# EAGLE design M633 (EAGLE 6.6.0)
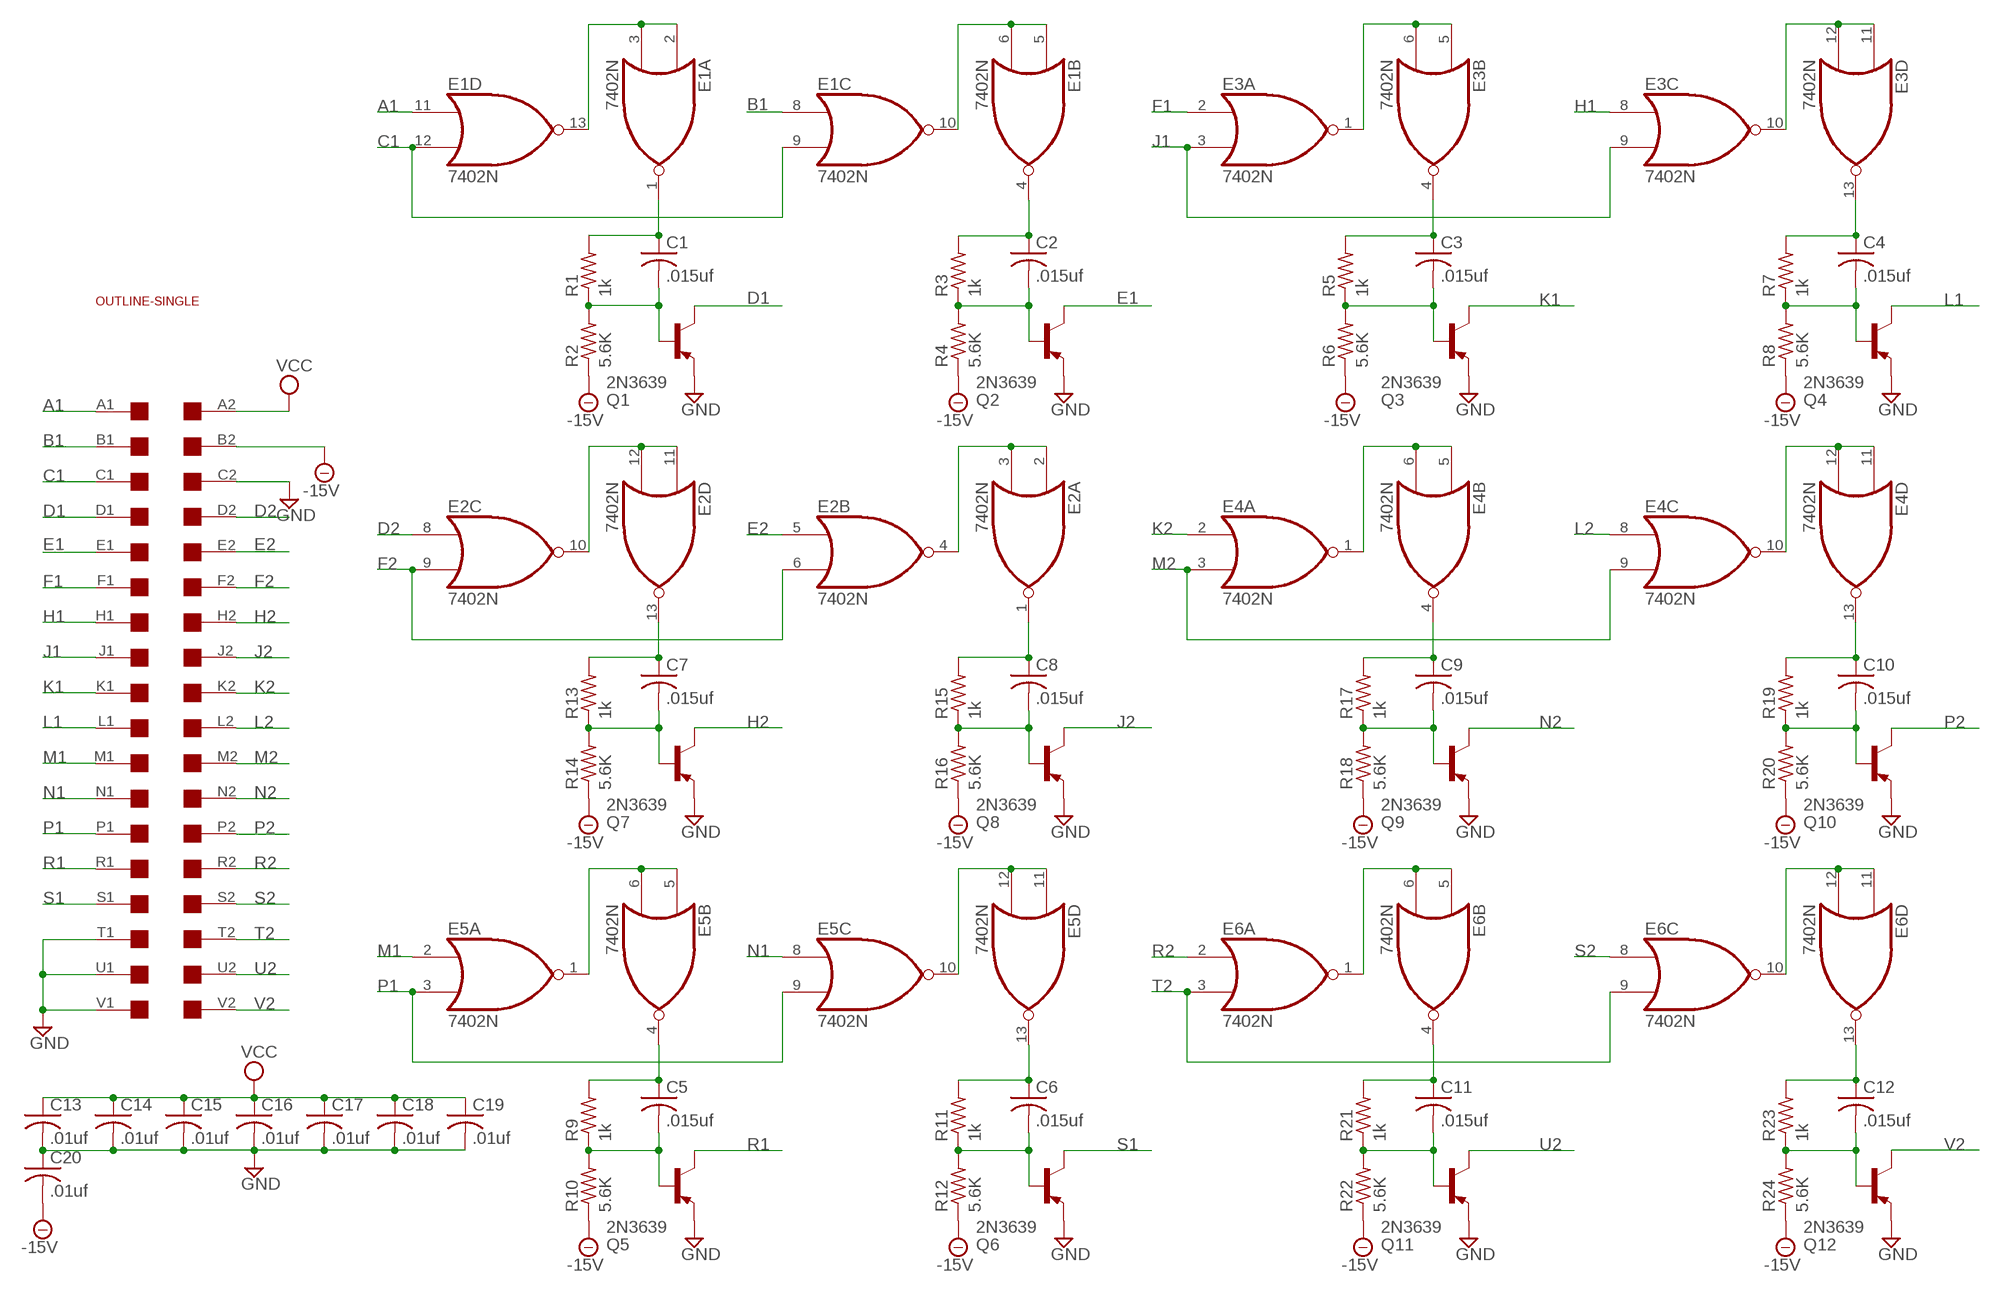
[diagram p0: schematic, sheet 1]

## Parts
C1  .015uf  C-US050-025X075  [C050-025X075]
C2  .015uf  C-US050-025X075  [C050-025X075]
C3  .015uf  C-US050-025X075  [C050-025X075]
C4  .015uf  C-US050-025X075  [C050-025X075]
C5  .015uf  C-US050-025X075  [C050-025X075]
C6  .015uf  C-US050-025X075  [C050-025X075]
C7  .015uf  C-US050-025X075  [C050-025X075]
C8  .015uf  C-US050-025X075  [C050-025X075]
C9  .015uf  C-US050-025X075  [C050-025X075]
C10  .015uf  C-US050-025X075  [C050-025X075]
C11  .015uf  C-US050-025X075  [C050-025X075]
C12  .015uf  C-US050-025X075  [C050-025X075]
C13  .01uf  C-US050-025X075  [C050-025X075]
C14  .01uf  C-US050-025X075  [C050-025X075]
C15  .01uf  C-US050-025X075  [C050-025X075]
C16  .01uf  C-US050-025X075  [C050-025X075]
C17  .01uf  C-US050-025X075  [C050-025X075]
C18  .01uf  C-US050-025X075  [C050-025X075]
C19  .01uf  C-US050-025X075  [C050-025X075]
C20  .01uf  C-US050-025X075  [C050-025X075]
E1  7402N  [DIL14]
E2  7402N  [DIL14]
E3  7402N  [DIL14]
E4  7402N  [DIL14]
E5  7402N  [DIL14]
E6  7402N  [DIL14]
Q1  2N3639  2N5415  [TO39]
Q2  2N3639  2N5415  [TO39]
Q3  2N3639  2N5415  [TO39]
Q4  2N3639  2N5415  [TO39]
Q5  2N3639  2N5415  [TO39]
Q6  2N3639  2N5415  [TO39]
Q7  2N3639  2N5415  [TO39]
Q8  2N3639  2N5415  [TO39]
Q9  2N3639  2N5415  [TO39]
Q10  2N3639  2N5415  [TO39]
Q11  2N3639  2N5415  [TO39]
Q12  2N3639  2N5415  [TO39]
R1  1k  R-US_0207/10  [0207/10]
R2  5.6K  R-US_0207/10  [0207/10]
R3  1k  R-US_0207/10  [0207/10]
R4  5.6K  R-US_0207/10  [0207/10]
R5  1k  R-US_0207/10  [0207/10]
R6  5.6K  R-US_0207/10  [0207/10]
R7  1k  R-US_0207/10  [0207/10]
R8  5.6K  R-US_0207/10  [0207/10]
R9  1k  R-US_0207/10  [0207/10]
R10  5.6K  R-US_0207/10  [0207/10]
R11  1k  R-US_0207/10  [0207/10]
R12  5.6K  R-US_0207/10  [0207/10]
R13  1k  R-US_0207/10  [0207/10]
R14  5.6K  R-US_0207/10  [0207/10]
R15  1k  R-US_0207/10  [0207/10]
R16  5.6K  R-US_0207/10  [0207/10]
R17  1k  R-US_0207/10  [0207/10]
R18  5.6K  R-US_0207/10  [0207/10]
R19  1k  R-US_0207/10  [0207/10]
R20  5.6K  R-US_0207/10  [0207/10]
R21  1k  R-US_0207/10  [0207/10]
R22  5.6K  R-US_0207/10  [0207/10]
R23  1k  R-US_0207/10  [0207/10]
R24  5.6K  R-US_0207/10  [0207/10]
U$1  SINGLE  [EDGE-CON2]
U$2  OUTLINE-SINGLE  [SINGLE]

## Nets
-15V: C20.2 R2.1 R4.1 R6.1 R8.1 R10.1 R12.1 R14.1 R16.1 R18.1 R20.1 R22.1 R24.1 U$1.B2
A1: E1.11(D:I0) U$1.A1
B1: E1.8(C:I0) U$1.B1
C1: E1.9(C:I1) E1.12(D:I1) U$1.C1
D1: Q1.3(C) U$1.D1
D2: E2.8(C:I0) U$1.D2
E1: Q2.3(C) U$1.E1
E2: E2.5(B:I0) U$1.E2
F1: E3.2(A:I0) U$1.F1
F2: E2.6(B:I1) E2.9(C:I1) U$1.F2
GND: C13.2 C14.2 C15.2 C16.2 C17.2 C18.2 C19.2 C20.1 Q1.1(E) Q2.1(E) Q3.1(E) Q4.1(E) Q5.1(E) Q6.1(E) Q7.1(E) Q8.1(E) Q9.1(E) Q10.1(E) Q11.1(E) Q12.1(E) U$1.C2 U$1.T1 U$1.U1 U$1.V1
H1: E3.8(C:I0) U$1.H1
H2: Q7.3(C) U$1.H2
J1: E3.3(A:I1) E3.9(C:I1) U$1.J1
J2: Q8.3(C) U$1.J2
K1: Q3.3(C) U$1.K1
K2: E4.2(A:I0) U$1.K2
L1: Q4.3(C) U$1.L1
L2: E4.8(C:I0) U$1.L2
M1: E5.2(A:I0) U$1.M1
M2: E4.3(A:I1) E4.9(C:I1) U$1.M2
N1: E5.8(C:I0) U$1.N1
N2: Q9.3(C) U$1.N2
N$1: E1.2(A:I0) E1.3(A:I1) E1.13(D:O)
N$2: C1.1 E1.1(A:O) R1.2
N$3: C1.2 Q1.2(B) R1.1 R2.2
N$4: C3.1 E3.4(B:O) R5.2
N$5: C2.1 E1.4(B:O) R3.2
N$6: C2.2 Q2.2(B) R3.1 R4.2
N$7: E1.5(B:I0) E1.6(B:I1) E1.10(C:O)
N$8: E2.10(C:O) E2.11(D:I0) E2.12(D:I1)
N$9: E2.2(A:I0) E2.3(A:I1) E2.4(B:O)
N$10: E4.1(A:O) E4.5(B:I0) E4.6(B:I1)
N$11: E4.10(C:O) E4.11(D:I0) E4.12(D:I1)
N$12: E6.10(C:O) E6.11(D:I0) E6.12(D:I1)
N$13: E6.1(A:O) E6.5(B:I0) E6.6(B:I1)
N$14: E5.10(C:O) E5.11(D:I0) E5.12(D:I1)
N$15: E5.1(A:O) E5.5(B:I0) E5.6(B:I1)
N$16: E3.10(C:O) E3.11(D:I0) E3.12(D:I1)
N$17: E3.1(A:O) E3.5(B:I0) E3.6(B:I1)
N$18: C4.1 E3.13(D:O) R7.2
N$19: C9.1 E4.4(B:O) R17.2
N$20: C10.1 E4.13(D:O) R19.2
N$21: C8.1 E2.1(A:O) R15.2
N$22: C7.1 E2.13(D:O) R13.2
N$23: C7.2 Q7.2(B) R13.1 R14.2
N$24: C8.2 Q8.2(B) R15.1 R16.2
N$25: C9.2 Q9.2(B) R17.1 R18.2
N$26: C10.2 Q10.2(B) R19.1 R20.2
N$27: C5.1 E5.4(B:O) R9.2
N$28: C5.2 Q5.2(B) R9.1 R10.2
N$29: C6.2 Q6.2(B) R11.1 R12.2
N$30: C11.2 Q11.2(B) R21.1 R22.2
N$31: C12.2 Q12.2(B) R23.1 R24.2
N$32: C6.1 E5.13(D:O) R11.2
N$33: C11.1 E6.4(B:O) R21.2
N$34: C12.1 E6.13(D:O) R23.2
N$35: C3.2 Q3.2(B) R5.1 R6.2
N$36: C4.2 Q4.2(B) R7.1 R8.2
P1: E5.3(A:I1) E5.9(C:I1) U$1.P1
P2: Q10.3(C) U$1.P2
R1: Q5.3(C) U$1.R1
R2: E6.2(A:I0) U$1.R2
S1: Q6.3(C) U$1.S1
S2: E6.8(C:I0) U$1.S2
T2: E6.3(A:I1) E6.9(C:I1) U$1.T2
U2: Q11.3(C) U$1.U2
V2: Q12.3(C) U$1.V2
VCC: C13.1 C14.1 C15.1 C16.1 C17.1 C18.1 C19.1 U$1.A2

## Power pins joined to a net without a drawn wire
GND: E1.7(P:GND) E2.7(P:GND) E3.7(P:GND) E4.7(P:GND) E5.7(P:GND) E6.7(P:GND)
VCC: E1.14(P:VCC) E2.14(P:VCC) E3.14(P:VCC) E4.14(P:VCC) E5.14(P:VCC) E6.14(P:VCC)

## Library data of the parts
C1-C20 = rcl:C-US: CAPACITOR, American symbol
E1-E6 = 74xx-us:74*02: Quad 2-input NOR gate
Q1-Q12 = transistor-pnp:2N5415*: PNP Transistror
R1-R24 = rcl:R-US_: RESISTOR, American symbol
U$1 = dec-con:SINGLE: Single-Height DEC board
U$2 = dec-con:OUTLINE-*: Board outlines for DEC boards.

## Board
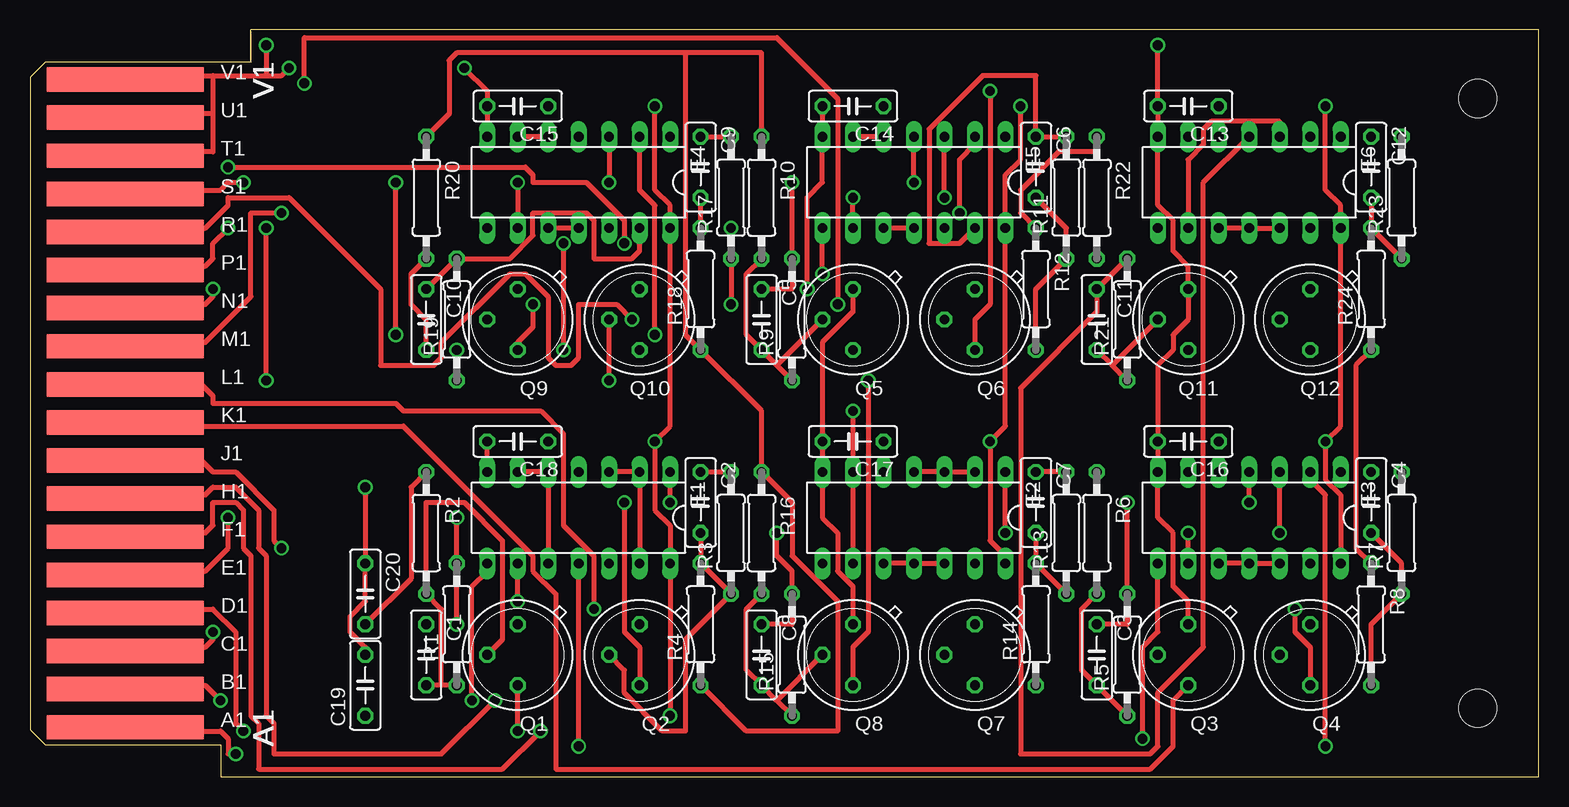
[diagram p1: board, top side]
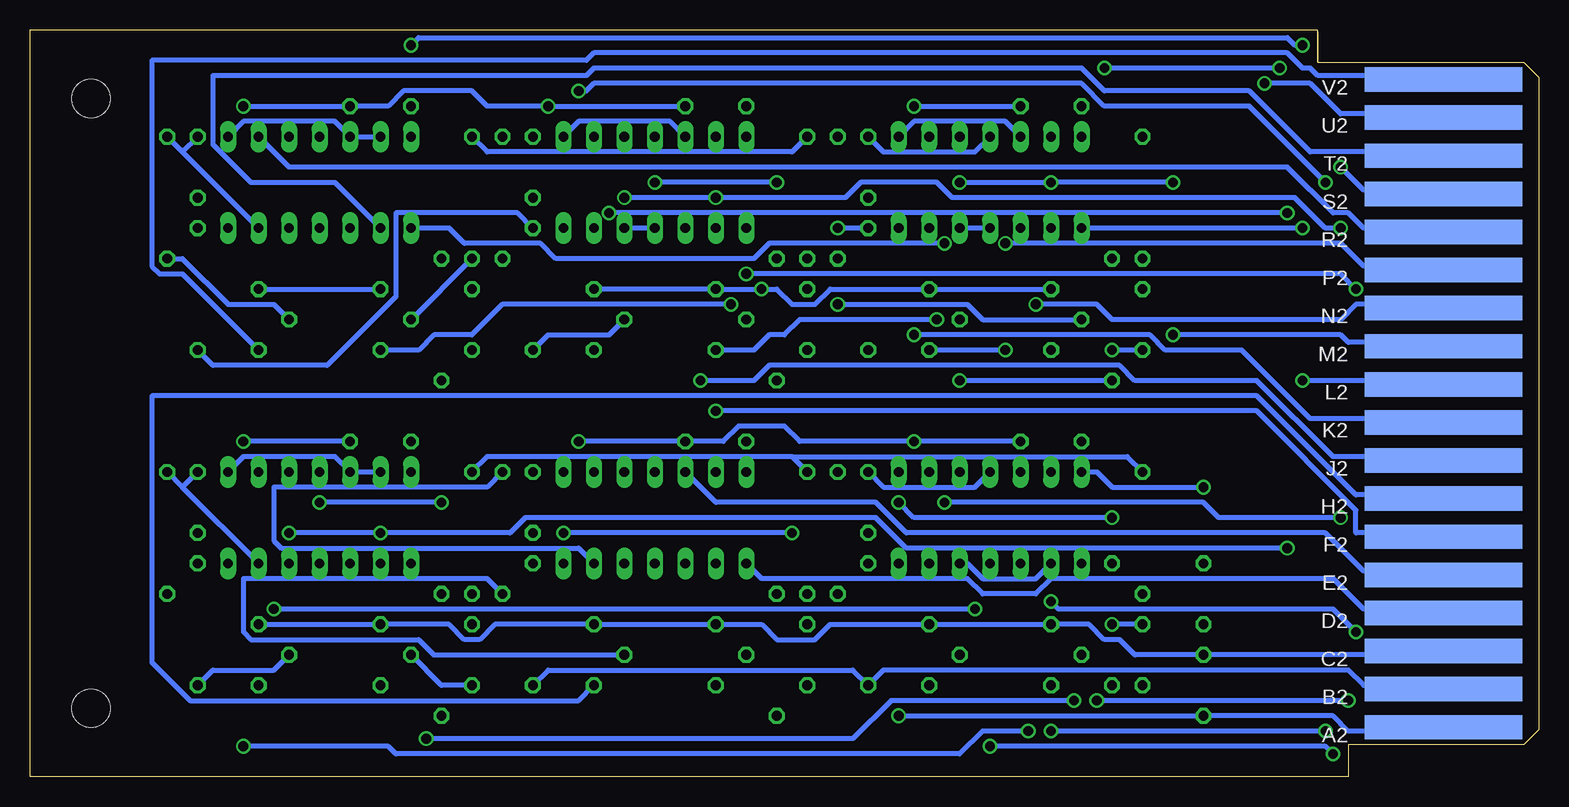
[diagram p2: board, bottom side, seen from below]

Size 125.73 x 62.23 mm. Coordinates in mm from the lower left corner, seen from the top.
Copper layers (1+16): Top 0.035mm / dielectric 1.5mm / Bottom 0.035mm
Design rules "16mils": minimum track width 16mil, minimum drill 32mil, track to track 15mil, track to pad 10mil, pad to pad 10mil, via to via 10mil, smd to smd 10mil, copper to edge 13mil, drill to drill 10mil, minimum pad ring 10mil, minimum via ring 8mil, stop-mask expansion 0mil, vias tented up to drill 0mil, thermal gap 10mil

### Footprints (pad centres in the part's own frame; a part is rotated, then mirrored left to right if it is on the bottom)
C050-025X075 = drill 0.813 octagon: 1 -2.54,0; 2 2.54,0
DIL14 = drill 0.813 long: 1 -7.62,-3.81; 2 -5.08,-3.81; 3 -2.54,-3.81; 4 0,-3.81; 5 2.54,-3.81; 6 5.08,-3.81; 7 7.62,-3.81; 8 7.62,3.81; 9 5.08,3.81; 10 2.54,3.81; 11 0,3.81; 12 -2.54,3.81; 13 -5.08,3.81; 14 -7.62,3.81
TO39 = drill 0.813 octagon: 1 0,-2.54; 2 2.54,0; 3 0,2.54
0207/10 = drill 0.813 octagon: 1 -5.08,0; 2 5.08,0
EDGE-CON2 = smd 13.106 x 2.032: A1 7.938,4.128; B1 7.938,7.303; C1 7.938,10.477; D1 7.938,13.652; E1 7.938,16.828; F1 7.938,20.003; H1 7.938,23.177; J1 7.938,26.352; K1 7.938,29.527; L1 7.938,32.703; M1 7.938,35.877; N1 7.938,39.053; P1 7.938,42.227; R1 7.938,45.403; S1 7.938,48.578; T1 7.938,51.752; U1 7.938,54.928; V1 7.938,58.102 | smd 13.106 x 2.032 bottom: A2 7.938,4.128; B2 7.938,7.303; C2 7.938,10.477; D2 7.938,13.652; E2 7.938,16.828; F2 7.938,20.003; H2 7.938,23.177; J2 7.938,26.352; K2 7.938,29.527; L2 7.938,32.703; M2 7.938,35.877; N2 7.938,39.053; P2 7.938,42.227; R2 7.938,45.403; S2 7.938,48.578; T2 7.938,51.752; U2 7.938,54.928; V2 7.938,58.102
SINGLE = hole 3.175: 120.65,56.515; 120.65,5.715

### Placement (x,y rotation side)
C1  33.02,10.16 270 top
C2  55.88,22.86 270 top
C3  88.9,10.16 270 top
C4  111.76,22.86 270 top
C5  60.96,38.1 270 top
C6  83.82,50.8 270 top
C7  83.82,22.86 270 top
C8  60.96,10.16 270 top
C9  55.88,50.8 270 top
C10  33.02,38.1 270 top
C11  88.9,38.1 270 top
C12  111.76,50.8 270 top
C13  96.52,55.88 180 top
C14  68.58,55.88 180 top
C15  40.64,55.88 180 top
C16  96.52,27.94 180 top
C17  68.58,27.94 180 top
C18  40.64,27.94 180 top
C19  27.94,7.62 90 top
C20  27.94,15.24 270 top
E1  45.72,21.59 180 top
E2  73.66,21.59 180 top
E3  101.6,21.59 180 top
E4  45.72,49.53 180 top
E5  73.66,49.53 180 top
E6  101.6,49.53 180 top
Q1  40.64,10.16 180 top
Q2  50.8,10.16 180 top
Q3  96.52,10.16 180 top
Q4  106.68,10.16 180 top
Q5  68.58,38.1 180 top
Q6  78.74,38.1 180 top
Q7  78.74,10.16 180 top
Q8  68.58,10.16 180 top
Q9  40.64,38.1 180 top
Q10  50.8,38.1 180 top
Q11  96.52,38.1 180 top
Q12  106.68,38.1 180 top
R1  35.56,12.7 90 top
R2  33.02,20.32 270 top
R3  58.42,20.32 90 top
R4  55.88,12.7 90 top
R5  91.44,10.16 90 top
R6  88.9,20.32 270 top
R7  114.3,20.32 90 top
R8  111.76,12.7 270 top
R9  63.5,38.1 90 top
R10  60.96,48.26 270 top
R11  86.36,48.26 90 top
R12  83.82,40.64 270 top
R13  86.36,20.32 90 top
R14  83.82,12.7 90 top
R15  63.5,10.16 90 top
R16  60.96,20.32 270 top
R17  58.42,48.26 90 top
R18  55.88,40.64 90 top
R19  35.56,38.1 90 top
R20  33.02,48.26 270 top
R21  91.44,38.1 90 top
R22  88.9,48.26 270 top
R23  114.3,48.26 90 top
R24  111.76,40.64 90 top
U$1  0,0 0 top
U$2  0,0 0 top

### Tracks (layer width: path | path; a pad name or v marks a point on that pad's centre or on a via)
-15V
  Top 0.406: C20.2 31.75,16.51 31.75,24.13 R2.1 | R8.1 110.49,19.05 110.49,34.29 R24.1 | R12.1 82.55,46.99 82.55,48.9 85.73,52.07 88.9,52.07 R22.1 | R20.1 34.93,55.24 34.93,59.69 35.56,60.33 54.61,60.33 | 54.61,60.33 60.96,60.33 R10.1 | 54.61,60.33 54.61,36.83 R18.1 60.96,30.48 R16.1 63.5,22.86 63.5,18.41 67.31,14.61 67.31,3.81 59.69,3.81 R4.1
  Bottom 0.406: R14.1 82.55,8.89 57.15,8.89 R4.1 54.61,8.89 15.88,8.89 14.61,7.62 7.94,7.62 U$1.B2 | R6.1 87.63,26.67 62.23,26.67 | R16.1 62.23,26.67 | R2.1 34.29,26.67 62.23,26.67 | R22.1 87.63,52.07 62.23,52.07 R10.1 | R24.1 110.49,34.29 100.97,34.29 95.25,40.01 95.25,46.99 85.09,46.99 R12.1
A1  (via drill 0.81)
  Top 0.406: v45.72,2.54 E1.11 | v17.15,1.91 16.51,1.91 16.51,3.17 15.88,3.81 9.53,3.81 8.89,4.45 8.26,4.45 U$1.A1
  Bottom 0.406: v45.72,2.54 17.78,2.54 v17.15,1.91
B1  (via drill 0.81)
  Top 0.406: E1.8 38.1,17.14 36.83,15.88 v36.83,6.35 | v15.88,6.35 14.61,7.62 8.26,7.62 U$1.B1
  Bottom 0.406: v15.88,6.35 v36.83,6.35
C1  (via drill 0.81)
  Top 0.406: v40.64,14.61 E1.9 | v15.24,12.06 15.24,11.43 14.61,10.79 8.26,10.79 U$1.C1
  Bottom 0.406: E1.9 41.91,16.51 46.36,16.51 47.63,17.78 E1.12 | v40.64,14.61 40.01,13.97 17.15,13.97 v15.24,12.06
D1  (via drill 0.81)
  Top 0.406: v40.64,3.81 Q1.3 | v17.78,3.81 17.15,4.45 17.15,12.06 15.24,13.97 8.26,13.97 U$1.D1
  Bottom 0.406: v17.78,3.81 v40.64,3.81
D2
  Bottom 0.406: E2.8 64.77,16.51 47.63,16.51 46.36,15.24 41.91,15.24 40.64,16.51 17.15,16.51 14.61,13.97 8.26,13.97 U$1.D2
E1  (via drill 0.81)
  Top 0.406: Q2.3 50.8,10.79 49.53,12.06 v49.53,22.86 | v16.51,21.59 16.51,19.05 14.61,17.14 8.26,17.14 U$1.E1
  Bottom 0.406: v49.53,22.86 27.94,22.86 26.67,21.59 v16.51,21.59
E2
  Bottom 0.406: E2.5 68.58,22.86 55.25,22.86 52.71,20.32 17.78,20.32 14.61,17.14 8.26,17.14 U$1.E2
F1  (via drill 0.81)
  Top 0.406: E3.2 106.68,24.77 107.95,23.5 v107.95,2.54 | v42.55,3.81 39.37,0.64 19.05,0.64 19.05,4.45 18.42,5.08 18.42,18.41 17.78,19.05 17.78,22.23 17.15,22.86 15.24,22.86 15.24,20.95 14.61,20.32 8.26,20.32 U$1.F1
  Bottom 0.406: v107.95,2.54 95.89,2.54 95.25,1.91 48.26,1.91 46.36,3.81 v42.55,3.81
F2  (via drill 0.81)
  Top 0.406: E2.9 E2.6 v68.58,30.48
  Bottom 0.406: v68.58,30.48 23.5,30.48 15.24,22.23 15.24,20.32 8.26,20.32 U$1.F2
GND  (via drill 0.81)
  Top 0.406: v27.94,24.13 C20.1 27.94,14.61 26.67,13.34 26.67,12.06 27.94,10.79 C19.2 | E1.7 C18.2 | E4.7 C15.2 38.1,57.15 v36.2,59.05 | v21.59,59.05 20.96,58.42 19.69,58.42 | 15.24,58.42 8.26,58.42 U$1.V1 | 15.24,58.42 19.69,58.42 | 15.24,58.42 15.24,55.24 | 15.24,55.24 15.24,52.07 8.26,52.07 U$1.T1 | 15.24,55.24 8.26,55.24 U$1.U1 | Q3.1 96.52,14.61 95.25,15.88 95.25,20.32 93.98,21.59 E3.7 C16.2 93.98,34.29 95.25,35.56 95.25,36.83 96.52,38.1 Q11.1 96.52,42.55 95.25,43.81 95.25,46.35 93.98,47.62 E6.7 C13.2 v93.98,60.96 | C14.2 E5.7 66.04,49.53 64.77,48.26 v64.77,40.64 | Q5.1 68.58,38.73 66.04,36.2 C17.2 E2.7 66.04,21.59 67.31,20.32 67.31,17.14 68.58,15.88 Q8.1 | v19.69,60.96 19.69,58.42
  Bottom 0.406: v27.94,24.13 35.56,24.13 36.83,25.4 E1.7 | U$1.C2 8.26,10.79 11.43,10.79 12.07,10.16 C19.2 33.66,10.16 34.93,11.43 36.2,11.43 37.47,12.7 Q1.1 Q2.1 59.06,12.7 60.33,11.43 63.5,11.43 64.77,12.7 Q8.1 Q7.1 87,12.7 88.27,11.43 89.54,11.43 90.81,12.7 Q3.1 Q4.1 | v21.59,59.05 v36.2,59.05 | Q12.1 Q11.1 | Q9.1 Q10.1 59.06,40.64 60.33,39.37 62.23,39.37 63.5,40.64 v64.77,40.64 Q5.1 Q6.1 | v19.69,60.96 20.32,60.96 20.96,61.59 93.35,61.59 v93.98,60.96
H1  (via drill 0.81)
  Top 0.406: E3.8 93.98,12.06 92.71,10.79 v92.71,3.17 | v38.74,6.35 34.29,1.91 20.32,1.91 20.32,4.45 19.69,5.08 19.69,18.41 19.05,19.05 19.05,22.23 17.15,24.13 15.24,24.13 14.61,23.5 8.26,23.5 U$1.H1
  Bottom 0.406: v92.71,3.17 57.15,3.17 53.98,6.35 v38.74,6.35
H2
  Bottom 0.406: Q7.3 80.01,6.35 112.4,6.35 115.57,9.53 115.57,31.75 23.5,31.75 15.24,23.5 8.26,23.5 U$1.H2
J1  (via drill 0.81)
  Top 0.406: v104.14,20.32 E3.3 | E3.9 v96.52,20.32 | v20.96,19.05 20.32,19.68 20.32,22.23 17.15,25.4 15.24,25.4 13.97,26.67 8.26,26.67 U$1.J1
  Bottom 0.406: v104.14,20.32 v96.52,20.32 85.73,20.32 84.46,21.59 55.25,21.59 52.71,19.05 v20.96,19.05
J2  (via drill 0.81)
  Top 0.406: Q8.3 68.58,10.79 69.85,12.06 v69.85,33.02
  Bottom 0.406: v69.85,33.02 65.41,33.02 64.14,34.29 34.93,34.29 33.66,33.02 23.5,33.02 17.15,26.67 8.26,26.67 U$1.J2
K1
  Top 0.406: Q3.3 95.25,6.35 95.25,2.54 93.35,0.64 43.82,0.64 43.82,15.24 41.91,17.14 41.91,18.41 31.12,29.21 8.26,29.21 U$1.K1
K2  (via drill 0.81)
  Top 0.406: E4.2 50.8,48.9 52.07,47.62 v52.07,36.83
  Bottom 0.406: v52.07,36.83 32.39,36.83 31.12,35.56 24.77,35.56 19.05,29.84 8.26,29.84 U$1.K2
L1  (via drill 0.81)
  Top 0.406: Q4.3 106.68,10.79 105.41,12.06 v105.41,13.97 | v46.99,13.97 46.99,18.41 44.45,20.95 44.45,28.57 42.55,30.48 31.12,30.48 30.48,31.11 15.24,31.11 15.24,31.75 13.97,33.02 8.26,33.02 U$1.L1
  Bottom 0.406: v46.99,13.97 v105.41,13.97
L2  (via drill 0.81)
  Top 0.406: v19.69,33.02 v19.69,45.72
  Bottom 0.406: v19.69,45.72 E4.8 | v19.69,33.02 8.26,33.02 U$1.L2
M1  (via drill 0.81)
  Top 0.406: E5.2 78.74,52.7 77.47,51.44 v77.47,46.99 | v20.96,46.99 18.42,46.99 18.42,40.01 14.61,36.2 8.26,36.2 U$1.M1
  Bottom 0.406: v20.96,46.99 v77.47,46.99
M2  (via drill 0.81)
  Top 0.406: v40.64,49.53 E4.9 | E4.3 v48.26,49.53 | v30.48,36.83 v30.48,49.53
  Bottom 0.406: v48.26,49.53 v40.64,49.53 v30.48,49.53 | v30.48,36.83 16.51,36.83 15.88,36.2 8.26,36.2 U$1.M2
N1  (via drill 0.81)
  Top 0.406: v66.04,41.91 E5.8 | v15.24,40.64 15.24,40.01 14.61,39.37 8.26,39.37 U$1.N1
  Bottom 0.406: v66.04,41.91 16.51,41.91 v15.24,40.64
N2  (via drill 0.81)
  Top 0.406: Q9.3 40.64,36.2 41.91,37.47 v41.91,39.37
  Bottom 0.406: v41.91,39.37 36.83,39.37 35.56,38.1 16.51,38.1 15.24,39.37 8.26,39.37 U$1.N2
N$1
  Top 0.406: E1.3 E1.2 E1.13
N$2  (via drill 0.81)
  Top 0.406: v35.56,12.7 R1.2 v35.56,21.59 | v53.34,22.86 E1.1
  Bottom 0.406: C1.1 v35.56,12.7 | v53.34,22.86 52.07,21.59 v35.56,21.59
N$3
  Top 0.406: R1.1 34.29,7.62 | 34.29,7.62 C1.2 | 34.29,7.62 34.29,13.97 R2.2 33.02,22.86 36.2,22.86 39.37,19.68 39.37,11.43 Q1.2
N$4  (via drill 0.81)
  Top 0.406: C3.1 91.44,12.7 R5.2 v91.44,22.86 | v101.6,22.86 E3.4
  Bottom 0.406: v91.44,22.86 v101.6,22.86
N$5
  Top 0.406: C2.1 R3.2
  Bottom 0.406: E1.4 46.99,24.13 54.61,24.13 C2.1
N$6
  Top 0.406: C2.2 R4.2 R3.1 54.61,11.43 54.61,3.81 52.71,3.81 49.53,6.99 49.53,8.89 Q2.2
N$7
  Top 0.406: E1.6 E1.5 E1.10
N$8
  Top 0.406: E2.10 E2.11 E2.12
N$9
  Top 0.406: E2.4 E2.3 E2.2
N$10
  Top 0.406: E4.5 E4.6
  Bottom 0.406: E4.1 52.07,54.61 44.45,54.61 E4.5
N$11
  Top 0.406: E4.11 E4.10
  Bottom 0.406: E4.11 E4.12
N$12
  Top 0.406: E6.10 E6.11 E6.12
N$13
  Bottom 0.406: E6.6 E6.5 100.33,54.61 107.95,54.61 E6.1
N$14
  Top 0.406: E5.11 E5.10
  Bottom 0.406: E5.11 E5.12
N$15
  Top 0.406: E5.5 E5.6
  Bottom 0.406: E5.1 80.01,54.61 72.39,54.61 E5.5
N$16
  Top 0.406: E3.10 E3.11 E3.12
N$17
  Bottom 0.406: E3.6 E3.5 100.33,26.67 107.95,26.67 E3.1
N$18
  Bottom 0.406: R7.2 113.03,24.13 | 113.03,24.13 E3.13 | 113.03,24.13 C4.1
N$19
  Top 0.406: C9.1 R17.2
  Bottom 0.406: E4.4 46.99,52.07 54.61,52.07 C9.1
N$20
  Top 0.406: C10.1 R19.2 40.01,43.18 41.91,45.09 41.91,46.99 46.36,46.99 46.99,46.35 46.99,43.18 50.17,43.18 50.8,43.81 E4.13
N$21  (via drill 0.81)
  Top 0.406: C8.1 63.5,12.7 R15.2 63.5,17.14 62.23,18.41 v62.23,20.32 | v81.28,20.32 E2.1
  Bottom 0.406: v62.23,20.32 v81.28,20.32
N$22
  Top 0.406: R13.2 C7.1
  Bottom 0.406: E2.13 80.01,19.05 104.78,19.05 105.41,19.68 105.41,24.13 87.63,24.13 R13.2
N$23
  Top 0.406: C7.2 R14.2 R13.1
  Bottom 0.406: Q7.2 92.08,10.16 93.35,11.43 107.32,11.43 107.95,12.06 107.95,16.51 87.63,16.51 R13.1
N$24
  Top 0.406: R15.1 62.23,6.35 | 62.23,6.35 C8.2 59.69,8.89 59.69,13.97 R16.2 | 62.23,6.35 Q8.2
N$25  (via drill 0.81)
  Top 0.406: v58.42,45.72 R17.1 v58.42,39.37 | R18.2 C9.2
  Bottom 0.406: R18.2 v58.42,45.72 | Q9.2 46.36,38.1 47.63,39.37 v58.42,39.37
N$26  (via drill 0.81)
  Top 0.406: R20.2 31.75,41.91 31.75,39.37 33.02,38.1 C10.2 | v35.56,35.56 R19.1 | v48.26,33.02 Q10.2
  Bottom 0.406: C10.2 v35.56,35.56 | R19.1 v48.26,33.02
N$27  (via drill 0.81)
  Top 0.406: C5.1 63.5,40.64 R9.2 v63.5,49.53 | v73.66,49.53 E5.4
  Bottom 0.406: v63.5,49.53 v73.66,49.53
N$28
  Top 0.406: R9.1 62.23,34.29 | 62.23,34.29 C5.2 59.69,36.83 59.69,41.91 R10.2 | 62.23,34.29 Q5.2
N$29
  Top 0.406: C6.2 86.36,45.72 R11.1 83.82,40.64 R12.2
  Bottom 0.406: Q6.2 77.47,36.83 82.55,36.83 R12.2
N$30
  Top 0.406: R21.1 90.17,34.29 | 90.17,34.29 C11.2 | Q11.2 90.17,34.29
  Bottom 0.406: Q11.2 R22.2
N$31
  Top 0.406: C12.2 R24.2 R23.1
  Bottom 0.406: Q12.2 105.41,39.37 109.22,39.37 113.03,43.18 R23.1
N$32
  Top 0.406: E5.13 77.47,44.45 74.93,44.45 74.93,53.98 79.38,58.42 83.82,58.42 C6.1 R11.2
N$33
  Top 0.406: R21.2 C11.1 88.9,38.73 82.55,32.38 82.55,1.91 93.35,1.91 93.98,2.54 93.98,6.99 97.79,10.79 97.79,49.53 E6.4
N$34
  Bottom 0.406: R23.2 113.03,52.07 | 113.03,52.07 E6.13 | 113.03,52.07 C12.1
N$35
  Top 0.406: R5.1 C3.2 87.63,8.89 87.63,13.97 R6.2
  Bottom 0.406: Q3.2 91.44,7.62 C3.2
N$36
  Top 0.406: C4.2 114.3,17.78 R7.1 111.76,12.7 R8.2
  Bottom 0.406: Q4.2 105.41,8.89 110.49,8.89 R8.2
P1  (via drill 0.81)
  Top 0.406: v76.2,48.26 E5.3 | E5.9 v68.58,48.26 | v16.51,45.72 15.24,44.45 15.24,43.18 14.61,42.55 8.26,42.55 U$1.P1
  Bottom 0.406: v76.2,48.26 v68.58,48.26 57.79,48.26 56.52,49.53 50.17,49.53 48.9,48.26 20.32,48.26 17.78,45.72 v16.51,45.72
P2  (via drill 0.81)
  Top 0.406: v44.45,44.45 v44.45,35.56
  Bottom 0.406: v44.45,35.56 Q10.3 | v44.45,44.45 16.51,44.45 14.61,42.55 8.26,42.55 U$1.P2
R1  (via drill 0.81)
  Top 0.406: v50.17,38.1 48.9,39.37 45.72,39.37 45.72,34.92 45.09,34.29 43.82,34.29 43.18,34.92 43.18,40.01 41.28,41.91 40.01,41.91 34.29,36.2 34.29,34.92 33.66,34.29 29.21,34.29 29.21,40.64 21.59,48.26 16.51,48.26 16.51,47.62 14.61,45.72 8.26,45.72 U$1.R1
  Bottom 0.406: Q5.3 65.41,35.56 64.14,36.83 62.87,36.83 61.6,38.1 v50.17,38.1
R2
  Bottom 0.406: E6.2 104.14,50.8 20.96,50.8 17.15,46.99 15.88,46.99 14.61,45.72 8.26,45.72 U$1.R2
S1  (via drill 0.81)
  Top 0.406: Q6.3 78.74,38.1 80.01,39.37 v80.01,57.15 | v17.78,49.53 16.51,49.53 15.88,48.9 8.26,48.9 U$1.S1
  Bottom 0.406: v80.01,57.15 79.38,57.15 78.74,57.78 38.1,57.78 36.2,55.88 24.13,55.88 v17.78,49.53
S2  (via drill 0.81)
  Top 0.406: v49.53,44.45 49.53,46.35 46.36,49.53 41.91,49.53 41.91,50.16 41.28,50.8 v16.51,50.8
  Bottom 0.406: E6.8 90.81,45.72 89.54,44.45 83.19,44.45 81.92,43.18 65.41,43.18 64.14,44.45 v49.53,44.45 | v16.51,50.8 14.61,48.9 8.26,48.9 U$1.S2
T2
  Top 0.406: E6.9 96.52,51.44 97.79,52.7 97.79,53.98 98.43,54.61 104.14,54.61 E6.3
  Bottom 0.406: E6.9 100.33,49.53 107.32,49.53 110.49,52.7 110.49,58.42 79.38,58.42 78.74,59.05 38.1,59.05 36.2,57.15 24.13,57.15 19.05,52.07 8.26,52.07 U$1.T2
U2  (via drill 0.81)
  Top 0.406: v67.31,39.37 67.31,56.52 62.23,61.59 22.86,61.59 v22.86,57.78
  Bottom 0.406: Q11.3 93.35,35.56 92.08,36.83 88.9,36.83 86.36,39.37 v67.31,39.37 | v22.86,57.78 19.05,57.78 16.51,55.24 8.26,55.24 U$1.U2
V2
  Bottom 0.406: Q12.3 113.03,41.91 114.94,41.91 115.57,42.55 115.57,59.69 79.38,59.69 78.74,60.33 20.96,60.33 19.69,59.05 19.05,59.05 18.42,58.42 8.26,58.42 U$1.V2
VCC  (via drill 0.81)
  Top 0.406: E3.14 109.22,23.5 107.95,24.77 v107.95,27.94 109.22,29.21 E6.14 109.22,47.62 107.95,48.9 v107.95,55.88 | E2.14 81.28,18.41 80.01,19.68 v80.01,27.94 81.28,29.21 E5.14 81.28,50.16 82.55,51.44 v82.55,55.88 | v52.07,55.88 52.07,48.9 53.34,47.62 E4.14 53.34,29.21 v52.07,27.94 52.07,22.23 53.34,20.95 E1.14 v53.34,5.08
  Bottom 0.406: C16.1 v107.95,27.94 | v107.95,55.88 C13.1 95.89,55.88 94.62,57.15 88.9,57.15 87.63,55.88 v82.55,55.88 C14.1 | v80.01,27.94 C17.1 67.95,27.94 66.68,29.21 62.87,29.21 61.6,27.94 v52.07,27.94 C18.1 | U$1.A2 8.26,3.81 15.88,3.81 17.15,5.08 C19.1 v53.34,5.08 | v52.07,55.88 C15.1

### Text on the board
tNames: V1 | V1 | V1 | V1 | V1 | V1 | V1 | V1 | V1 | V1 | V1 | V1 | V1 | V1 | V1 | V1 | V1 | V1 | V1 | V1 | V1 | V1 | V1 | V1 | V1 | V1 | V1 | V1 | V1 | V1 | V1 | V1 | A1 | A1 | A1 | A1 | A1 | A1 | A1 | A1 | A1 | A1 | A1 | A1 | A1 | A1 | A1 | A1 | A1 | A1 | A1 | A1 | A1 | A1 | A1 | A1 | A1 | A1 | A1 | A1 | A1 | A1 | A1 | A1